# EAGLE design tc_breakout (EAGLE 9.6.2)

## Sheet 1 of 2
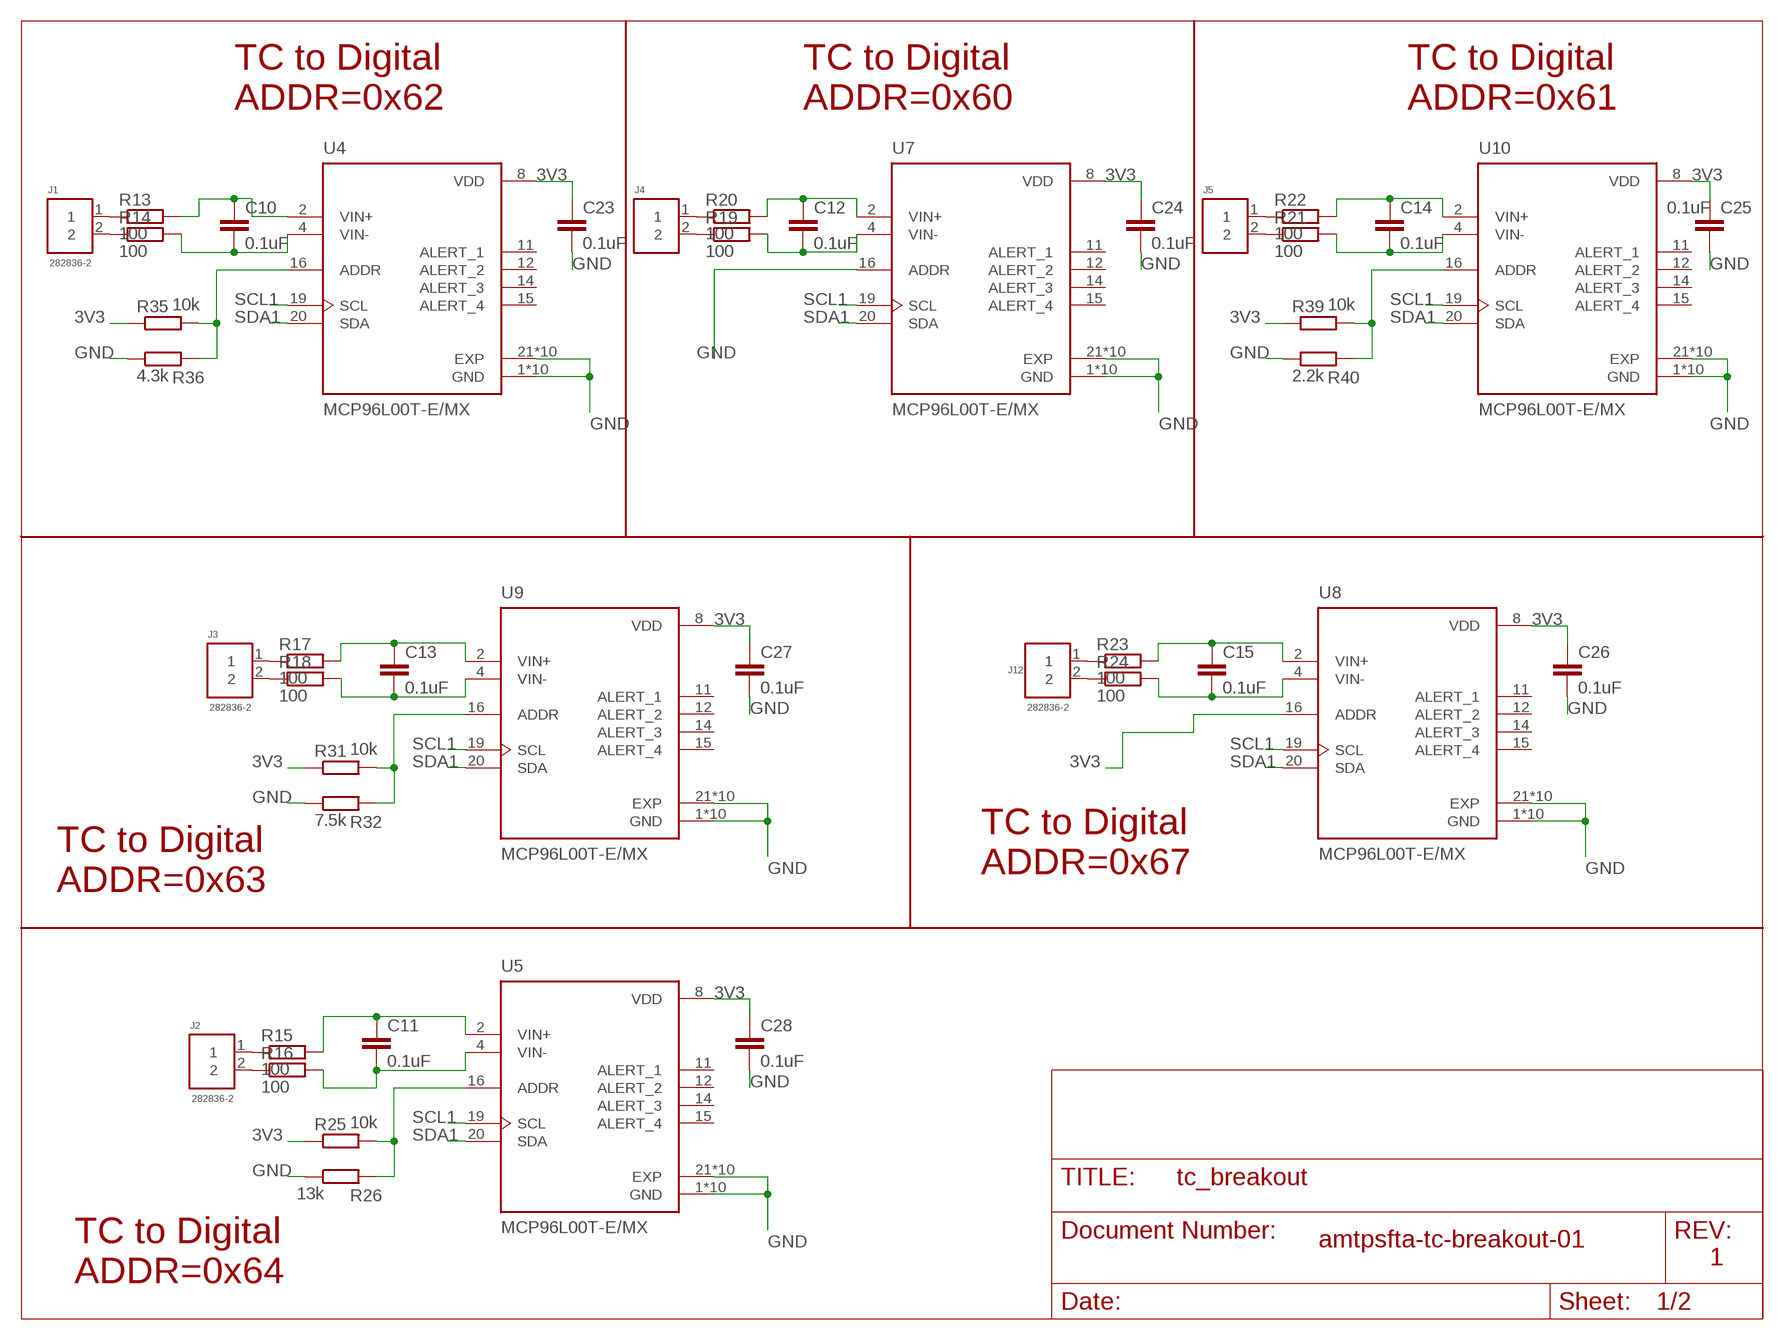
[diagram p0: schematic, sheet 1]

### Parts
C10  0.1uF  C-EUC0603  [C0603]
C11  0.1uF  C-EUC0603  [C0603]
C12  0.1uF  C-EUC0603  [C0603]
C13  0.1uF  C-EUC0603  [C0603]
C14  0.1uF  C-EUC0603  [C0603]
C15  0.1uF  C-EUC0603  [C0603]
C23  0.1uF  C-EUC0603  [C0603]
C24  0.1uF  C-EUC0603  [C0603]
C25  0.1uF  C-EUC0603  [C0603]
C26  0.1uF  C-EUC0603  [C0603]
C27  0.1uF  C-EUC0603  [C0603]
C28  0.1uF  C-EUC0603  [C0603]
J1  282836-2  [CONN_282836-2]
J2  282836-2  [CONN_282836-2]
J3  282836-2  [CONN_282836-2]
J4  282836-2  [CONN_282836-2]
J5  282836-2  [CONN_282836-2]
J12  282836-2  [CONN_282836-2]
R13  100  R-EU_R0603  [R0603]
R14  100  R-EU_R0603  [R0603]
R15  100  R-EU_R0603  [R0603]
R16  100  R-EU_R0603  [R0603]
R17  100  R-EU_R0603  [R0603]
R18  100  R-EU_R0603  [R0603]
R19  100  R-EU_R0603  [R0603]
R20  100  R-EU_R0603  [R0603]
R21  100  R-EU_R0603  [R0603]
R22  100  R-EU_R0603  [R0603]
R23  100  R-EU_R0603  [R0603]
R24  100  R-EU_R0603  [R0603]
R25  10k  R-EU_R0603  [R0603]
R26  13k  R-EU_R0603  [R0603]
R31  10k  R-EU_R0603  [R0603]
R32  7.5k  R-EU_R0603  [R0603]
R35  10k  R-EU_R0603  [R0603]
R36  4.3k  R-EU_R0603  [R0603]
R39  10k  R-EU_R0603  [R0603]
R40  2.2k  R-EU_R0603  [R0603]
U4  MCP96L00T-E/MX  [QFN65P500X500X100-21N_MCP96L00T-E/MX]
U5  MCP96L00T-E/MX  [QFN65P500X500X100-21N_MCP96L00T-E/MX]
U7  MCP96L00T-E/MX  [QFN65P500X500X100-21N_MCP96L00T-E/MX]
U8  MCP96L00T-E/MX  [QFN65P500X500X100-21N_MCP96L00T-E/MX]
U9  MCP96L00T-E/MX  [QFN65P500X500X100-21N_MCP96L00T-E/MX]
U10  MCP96L00T-E/MX  [QFN65P500X500X100-21N_MCP96L00T-E/MX]

### Nets
3V3: C23.1 C24.1 C25.1 C26.1 C27.1 C28.1 R25.1 R31.1 R35.1 R39.1 U4.8(VDD) U5.8(VDD) U7.8(VDD) U8.8(VDD) U8.16(ADDR) U9.8(VDD) U10.8(VDD) ; also sheet 2
GND: C23.2 C24.2 C25.2 C26.2 C27.2 C28.2 R26.1 R32.1 R36.1 R40.1 U4.1(GND) U4.3(GND) U4.5(GND) U4.6(GND) U4.7(GND) U4.9(GND) U4.10(GND) U4.13(GND) U4.17(GND) U4.18(GND) U4.21(EXP) U4.22(EXP) U4.23(EXP) U4.24(EXP) U4.25(EXP) U4.26(EXP) U4.27(EXP) U4.28(EXP) U4.29(EXP) U4.30(EXP) U5.1(GND) U5.3(GND) U5.5(GND) U5.6(GND) U5.7(GND) U5.9(GND) U5.10(GND) U5.13(GND) U5.17(GND) U5.18(GND) U5.21(EXP) U5.22(EXP) U5.23(EXP) U5.24(EXP) U5.25(EXP) U5.26(EXP) U5.27(EXP) U5.28(EXP) U5.29(EXP) U5.30(EXP) U7.1(GND) U7.3(GND) U7.5(GND) U7.6(GND) U7.7(GND) U7.9(GND) U7.10(GND) U7.13(GND) U7.16(ADDR) U7.17(GND) U7.18(GND) U7.21(EXP) U7.22(EXP) U7.23(EXP) U7.24(EXP) U7.25(EXP) U7.26(EXP) U7.27(EXP) U7.28(EXP) U7.29(EXP) U7.30(EXP) U8.1(GND) U8.3(GND) U8.5(GND) U8.6(GND) U8.7(GND) U8.9(GND) U8.10(GND) U8.13(GND) U8.17(GND) U8.18(GND) U8.21(EXP) U8.22(EXP) U8.23(EXP) U8.24(EXP) U8.25(EXP) U8.26(EXP) U8.27(EXP) U8.28(EXP) U8.29(EXP) U8.30(EXP) U9.1(GND) U9.3(GND) U9.5(GND) U9.6(GND) U9.7(GND) U9.9(GND) U9.10(GND) U9.13(GND) U9.17(GND) U9.18(GND) U9.21(EXP) U9.22(EXP) U9.23(EXP) U9.24(EXP) U9.25(EXP) U9.26(EXP) U9.27(EXP) U9.28(EXP) U9.29(EXP) U9.30(EXP) U10.1(GND) U10.3(GND) U10.5(GND) U10.6(GND) U10.7(GND) U10.9(GND) U10.10(GND) U10.13(GND) U10.17(GND) U10.18(GND) U10.21(EXP) U10.22(EXP) U10.23(EXP) U10.24(EXP) U10.25(EXP) U10.26(EXP) U10.27(EXP) U10.28(EXP) U10.29(EXP) U10.30(EXP) ; also sheet 2
N$22: J1.1 R13.1
N$25: J1.2 R14.1
N$28: J12.1 R23.1
N$32: C10.1 R13.2 U4.2(VIN+)
N$34: C10.2 R14.2 U4.4(VIN-)
N$36: J2.1 R15.1
N$37: J2.2 R16.1
N$38: J3.1 R17.1
N$39: J3.2 R18.1
N$40: J4.2 R19.1
N$41: J4.1 R20.1
N$42: J5.2 R21.1
N$43: J5.1 R22.1
N$44: J12.2 R24.1
N$45: C12.1 R20.2 U7.2(VIN+)
N$46: C12.2 R19.2 U7.4(VIN-)
N$47: C15.1 R23.2 U8.2(VIN+)
N$48: C14.2 R21.2 U10.4(VIN-)
N$49: C15.2 R24.2 U8.4(VIN-)
N$50: C14.1 R22.2 U10.2(VIN+)
N$51: C13.1 R17.2 U9.2(VIN+)
N$53: C13.2 R18.2 U9.4(VIN-)
N$54: C11.1 R15.2 U5.2(VIN+)
N$55: C11.2 R16.2 U5.4(VIN-)
N$57: R25.2 R26.2 U5.16(ADDR)
N$58: R31.2 R32.2 U9.16(ADDR)
N$60: R35.2 R36.2 U4.16(ADDR)
N$62: R39.2 R40.2 U10.16(ADDR)
SCL1: U4.19(SCL) U5.19(SCL) U7.19(SCL) U8.19(SCL) U9.19(SCL) U10.19(SCL) ; also sheet 2
SDA1: U4.20(SDA) U5.20(SDA) U7.20(SDA) U8.20(SDA) U9.20(SDA) U10.20(SDA) ; also sheet 2
Unconnected: U4.11(ALERT_1) U4.12(ALERT_2) U4.14(ALERT_3) U4.15(ALERT_4) U5.11(ALERT_1) U5.12(ALERT_2) U5.14(ALERT_3) U5.15(ALERT_4) U7.11(ALERT_1) U7.12(ALERT_2) U7.14(ALERT_3) U7.15(ALERT_4) U8.11(ALERT_1) U8.12(ALERT_2) U8.14(ALERT_3) U8.15(ALERT_4) U9.11(ALERT_1) U9.12(ALERT_2) U9.14(ALERT_3) U9.15(ALERT_4) U10.11(ALERT_1) U10.12(ALERT_2) U10.14(ALERT_3) U10.15(ALERT_4)

### Notes on the sheet
- TC to Digital
  ADDR=0x62
- TC to Digital
  ADDR=0x60
- TC to Digital
  ADDR=0x61
- TC to Digital
  ADDR=0x67
- TC to Digital
  ADDR=0x63
- amtpsfta-tc-breakout-01
- 1
- TC to Digital
  ADDR=0x64

## Sheet 2 of 2
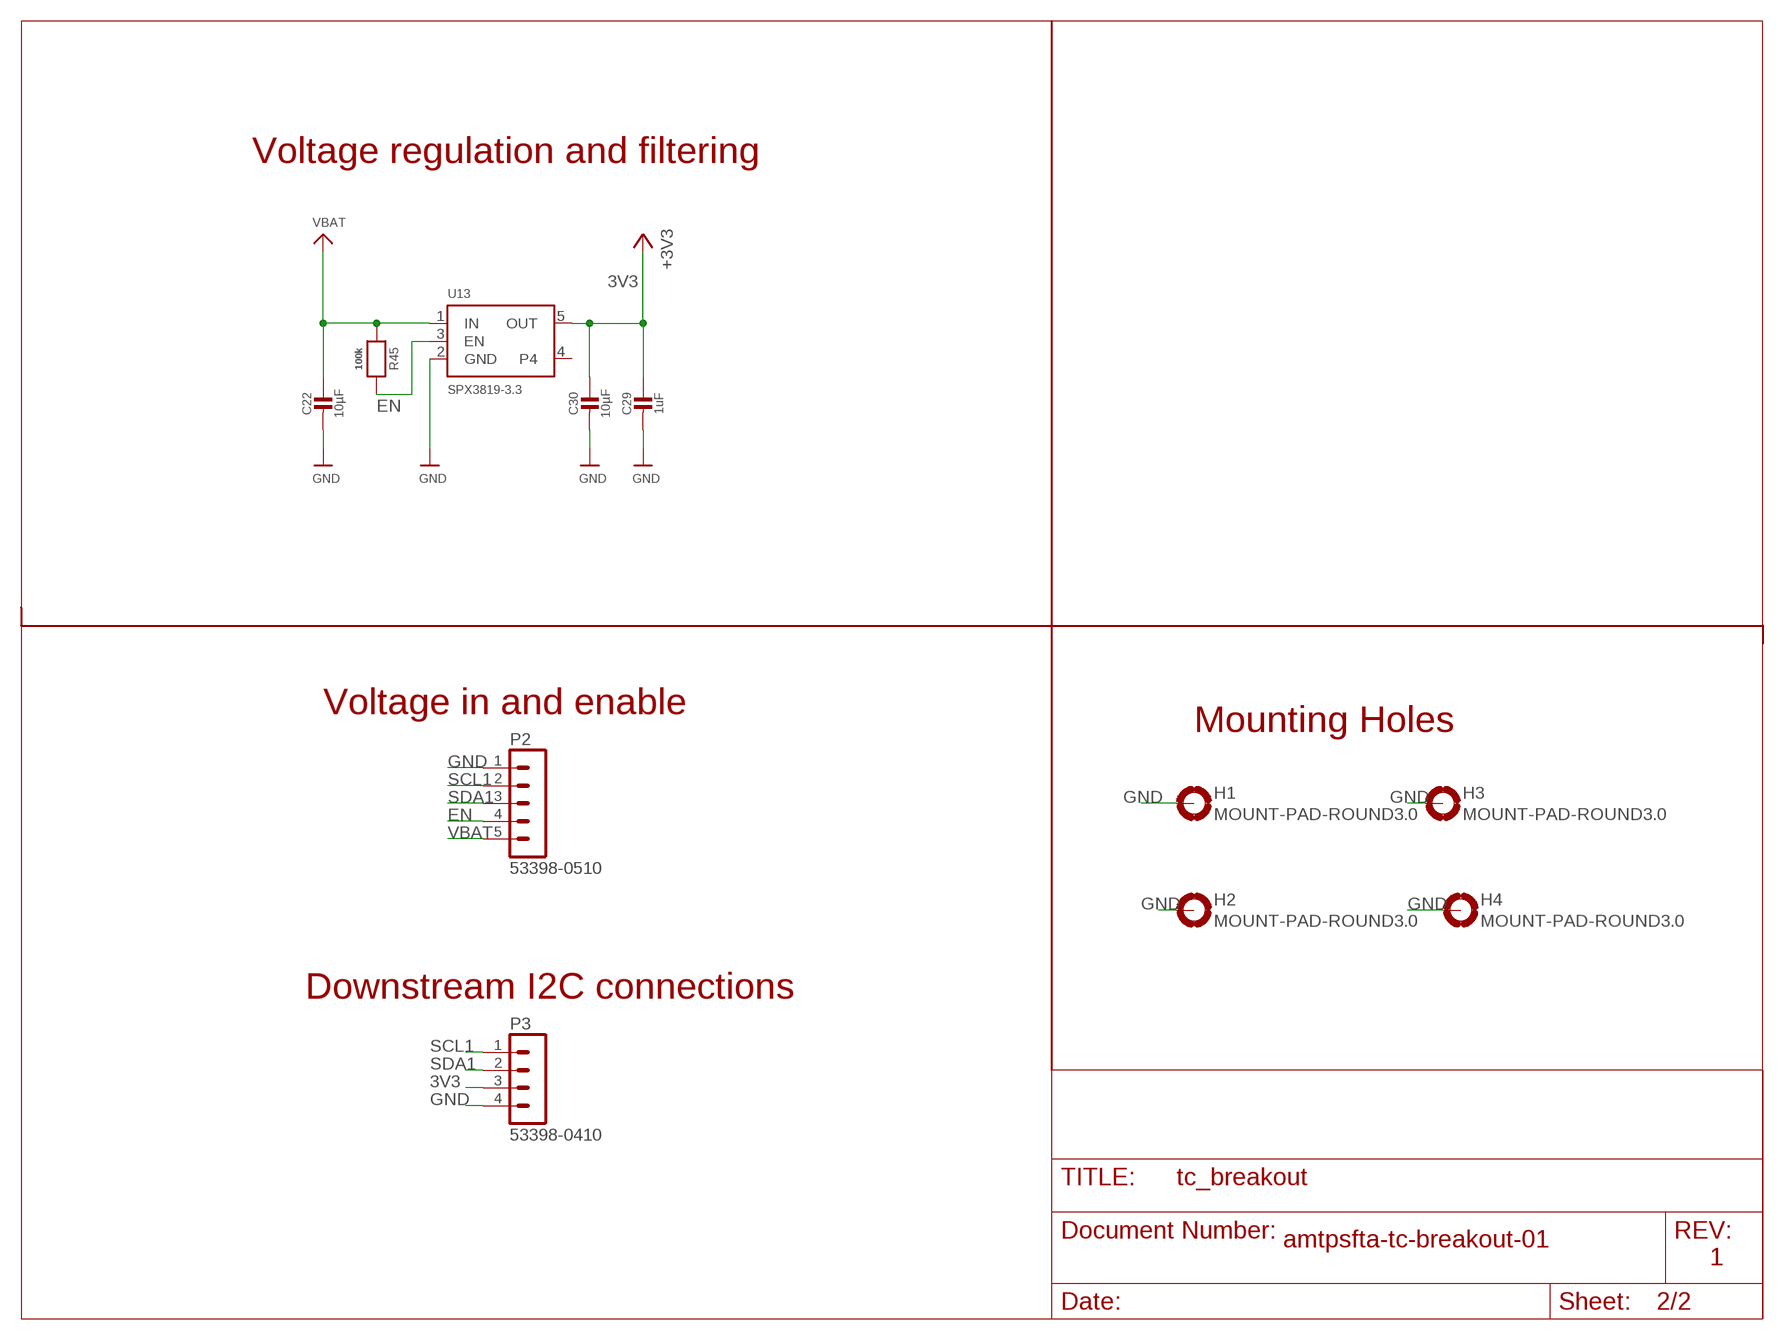
[diagram p1: schematic, sheet 2]

### Parts
C22  10µF  CAP_CERAMIC0805-NOOUTLINE  [0805-NO]
C29  1uF  CAP_CERAMIC0603_NO  [0603-NO]
C30  10µF  CAP_CERAMIC0805-NOOUTLINE  [0805-NO]
H1  MOUNT-PAD-ROUND3.0  [3,0-PAD]
H2  MOUNT-PAD-ROUND3.0  [3,0-PAD]
H3  MOUNT-PAD-ROUND3.0  [3,0-PAD]
H4  MOUNT-PAD-ROUND3.0  [3,0-PAD]
P2  53398-0510  [53398-0510]
P3  53398-0410  [53398-0410]
R45  100k  RESISTOR_0603_NOOUT  [0603-NO]
U13  SPX3819-3.3  VREG_SOT23-5  [SOT23-5]

### Nets
3V3: C29.1 C30.1 P3.3 U13.5(OUT) ; supply symbol labelled +3V3 ; also sheet 1
EN: P2.4 R45.2 U13.3(EN)
GND: C22.2 C29.2 C30.2 H1.B3,0(MOUNT) H2.B3,0(MOUNT) H3.B3,0(MOUNT) H4.B3,0(MOUNT) P2.1 P3.4 U13.2(GND) ; also sheet 1
SCL1: P2.2 P3.1 ; also sheet 1
SDA1: P2.3 P3.2 ; also sheet 1
VBAT: C22.1 P2.5 R45.1 U13.1(IN)
Unconnected: U13.4

### Notes on the sheet
- Voltage regulation and filtering
- Voltage in and enable
- Mounting Holes
- Downstream I2C connections
- amtpsfta-tc-breakout-01
- 1

## Library data of the parts
C10-C15 C23-C28 = rcl:C-EU: CAPACITOR, European symbol; SPICEPREFIX: C
C22 C29 C30 = microbuilder:CAP_CERAMIC: Ceramic Capacitors For new designs, use the packages preceded by an '_' character since they are more reliable: The following footprints should be used on most boards: _0402 - Standard footprint for regular board layouts _0603 - Standard footprint for regular board layouts _0805 - Standard footprint for regular board layouts _1206 - Standard footprint for regular board layouts For extremely tight-pitch boards where space is at a premium, the following 'micro-pitch' footprints can be used (smaller pads, no silkscreen outline, etc.): _0402MP - Micro-pitch footprint for very dense/compact boards _0603MP - Micro-pitch footprint for very dense/compact boards _0805MP - Micro-pitch footprint for very dense/compact boards _1206MP - Micro-pitch footprint for very dense/compact boards
H1-H4 = holes:MOUNT-PAD-ROUND: MOUNTING PAD, round
J1-J5 J12 = 282836-2:282836-2: TERM BLOCK 2POS SIDE ENTRY 5MM; DESCRIPTION: Conn Eurostyle Block 2 POS 5mm Solder ST Thru-Hole 13.5A/Contact; MF: TE Connectivity; MP: 2828362; PACKAGE: None
P2 = con-molex-picoblade:53398-0510: HEADER
P3 = con-molex-picoblade:53398-0410: HEADER
R13-R26 R31 R32 R35 R36 R39 R40 = rcl:R-EU_: RESISTOR, European symbol; SPICEPREFIX: R
R45 = microbuilder:RESISTOR: Resistors For new designs, use the packages preceded by an '_' character since they are more reliable: The following footprints should be used on most boards: _0402 - Standard footprint for regular board layouts _0603 - Standard footprint for regular board layouts _0805 - Standard footprint for regular board layouts _1206 - Standard footprint for regular board layouts For extremely tight-pitch boards where space is at a premium, the following 'micro-pitch' footprints can be used (smaller pads, no silkscreen outline, etc.): _0402MP - Micro-pitch footprint for very dense/compact boards _0603MP - Micro-pitch footprint for very dense/compact boards _0805MP - Micro-pitch footprint for very dense/compact boards _1206MP - Micro-pitch footprint for very dense/compact boards
U4 U5 U7-U10 = MCP96L00T-E_MX:MCP96L00T-E/MX: MCP9600 Series Thermocouple Electromotive Force to ±1.5°C Converter - VQFN-2; DESCRIPTION: +/- 4.0C THERMOCOUPLE TO I2C CON; DIGI-KEY_PART_NUMBER: MCP96L00T-E/MXCT-ND; MF: Microchip Technology; MP: MCP96L00T-E/MX; PACKAGE: VQFN-20 Microchip; PURCHASE-URL: https://pricing.snapeda.com/search/part/MCP96L00T-E/MX/?ref=eda
U13 = microbuilder:VREG_SOT23-5: SOT23-5 Fixed Voltage Regulators Part Current Out V Out V In V Dropout θJA (°C/W) TJ (°C) Digikey Part No. ADP121 150mA 3.3V 3.4-5.5V 0.09V @ 150mA -- -- ADP121-AUJZ33R7CT-ND ADP121 150mA 3.0V 3.1-5.5V 0.09V @ 150mA -- -- ADP121-AUJZ30R7CT-ND ADP122 300mA 3.3V 3.4-5.5V 0.085V @ 300mA -- -- ADP122AUJZ-3.3-R7CT-ND ADP1712 300mA 3.3V 3.5-5.5V 0.17V @ 300mA -- -- ADP1712AUJZ-3.3-R7TR-ND AP7311 (Low Cost) 150mA 3.3V 3.5-6V 0.15V @ 150mA -- -- AP7311-33WG-7DICT-ND LD39015M18R 150mA 1.8V 1.9V-5.5V 0.08V @ 100mA -- -- 497-6977-1-ND LP2985A-33DBVR 150mA 3.3V 3.3-16V 0.28V @ 150mA 206 150 296-18479-1-ND MCP1824T-3302E/OT 300mA 3.3V 3.5V-6V 0.2V @ 300mA -- -- MCP1824T-3302E/OTCT-ND MIC5205-2.5YM5 TR 150mA 2.5V 2.7-16V 0.165V @ 150mA -- -- 576-1257-2-ND MIC5205-3.0YM5 TR 150mA 3.0V 3.2V-16V 0.165V @ 150mA -- -- 576-1258-2-ND MIC5205-3.3YM5 TR 150mA 3.3V 3.5V-16V 0.165V @ 150mA -- -- 576-1259-2-ND TPS780330220 150mA 3.3V+2.2V 3.6-5.5V 250mV Max -- -- 296-23332-1-ND TDA3663/N1,135 100mA 3.3V 3.5-45V 0.18V @ 50mA -- -- 568-5343-1-ND Max operating temp can be calculated using θJA, TJ (max junction temperature), and power in watts. Set the "Maximum Ambient Temperature" until it reaches TJ ("Max Junction Temperature"), which is the absolute limit for safe use of the regulator: Heat Sink Temperature Calculator <http://www.daycounter.com/Calculators/Heat-Sink-Temperature-Calculator.phtml> For example, With 12V source into a 3.3V LP2985 and a 30mA load, we are dissipating (12V-3.3V) * 0.03A = 0.261W. With a θJA of 206 °C/W, a TJ of 150°C, and 261mW we can safely use the chip without a heat sink up to 75°C (=147.1°C Junction Temperature).

## Board
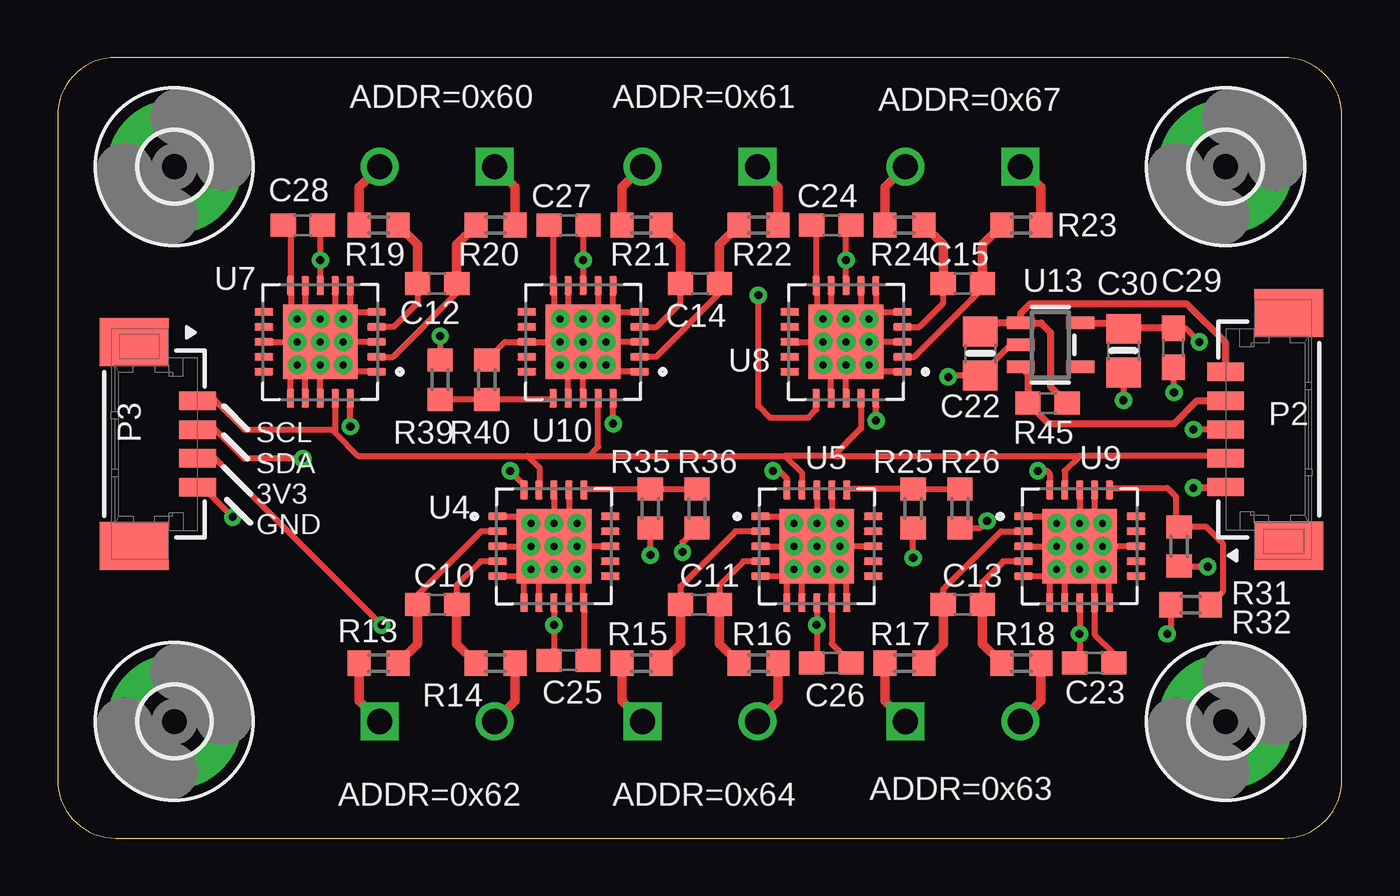
[diagram p2: board, top side]
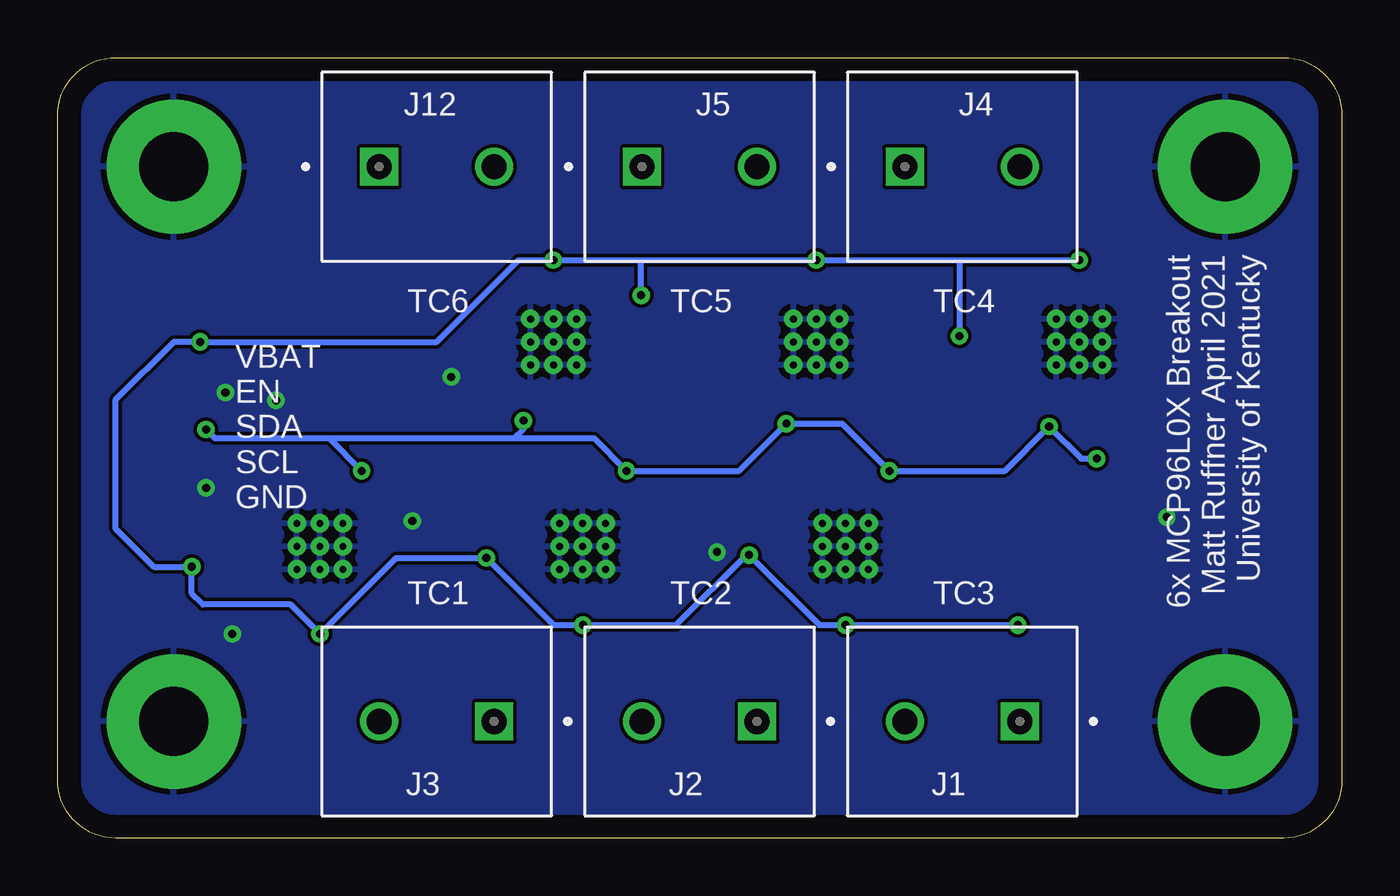
[diagram p3: board, bottom side, seen from below]

Size 55.86 x 33.96 mm. Coordinates in mm from the lower left corner, seen from the top.
Outline: 0,31.42 0,2.54 arc90 2.54,0 53.32,0 arc90 55.86,2.54 55.86,31.42 arc90 53.32,33.96 2.54,33.96 arc90 0,31.42
Copper layers (1*16): Top 0.035mm / dielectric 1.5mm / Bottom 0.035mm
Design rules "default *": minimum track width 6mil, minimum drill 0.35mm, track to track 6mil, track to pad 6mil, pad to pad 6mil, via to via 6mil, smd to smd 6mil, copper to edge 40mil, drill to drill 6mil, minimum pad ring 10mil, minimum via ring 8mil, stop-mask expansion 4mil, vias tented up to drill 14mil, thermal gap 10mil

### Footprints (pad centres in the part's own frame; a part is rotated, then mirrored left to right if it is on the bottom)
C0603 = smd 1.1 x 1: 1 -0.85,0; 2 0.85,0
0805-NO = smd 1.3 x 1.5: 1 -0.95,0; 2 0.95,0
0603-NO = smd 1.1 x 1: 1 -0.85,0; 2 0.85,0
3,0-PAD = drill 3 pad 5.842: B3,0 0,0
CONN_282836-2 = drill 1.1 square: 1 -2.5,0 | drill 1.1: 2 2.5,0
53398-0510 = smd 0.8 x 1.6: 1 2.5,0; 2 1.25,0; 3 0,0; 4 -1.25,0; 5 -2.5,0 | smd 2.1 x 3: M1 5.06,2.75; M2 -5.06,2.75
53398-0410 = smd 0.8 x 1.6: 1 1.875,0; 2 0.625,0; 3 -0.625,0; 4 -1.875,0 | smd 2.1 x 3: M1 4.435,2.75; M2 -4.435,2.75
R0603 = smd 1 x 1.1: 1 -0.85,0; 2 0.85,0
QFN65P500X500X100-21N_MCP96L00T-E/MX = smd 0.81 x 0.32: 1 -2.45,1.3; 2 -2.45,0.65; 3 -2.45,0; 4 -2.45,-0.65; 5 -2.45,-1.3; 11 2.45,-1.3; 12 2.45,-0.65; 13 2.45,0; 14 2.45,0.65; 15 2.45,1.3 | smd 0.32 x 0.81: 6 -1.3,-2.45; 7 -0.65,-2.45; 8 0,-2.45; 9 0.65,-2.45; 10 1.3,-2.45; 16 1.3,2.45; 17 0.65,2.45; 18 0,2.45; 19 -0.65,2.45; 20 -1.3,2.45 | smd 3.25 x 3.25: 21 0,0 | drill 0.3 pad 0.5: 22 -1,1; 23 0,1; 24 1,1; 25 -1,0; 26 0,0; 27 1,0; 28 -1,-1; 29 0,-1; 30 1,-1
SOT23-5 = smd 0.55 x 1.2: 1 -0.95,-1.3; 2 0,-1.3; 3 0.95,-1.3; 4 0.95,1.3; 5 -0.95,1.3

### Placement (x,y rotation side)
C10  16.51,10.16 0 top
C11  27.94,10.16 0 top
C12  16.51,24.13 180 top
C13  39.37,10.16 0 top
C14  27.94,24.13 180 top
C15  39.37,24.13 180 top
C22  40.13,21.08 270 top
C23  45.09,7.62 0 top
C24  33.66,26.67 180 top
C25  22.23,7.75 0 top
C26  33.66,7.62 0 top
C27  22.23,26.67 180 top
C28  10.67,26.67 180 top
C29  48.51,21.34 270 top
C30  46.35,21.21 270 top
H1  5.08,5.08 0 top
H2  50.8,5.08 0 top
H3  5.08,29.21 0 top
H4  50.8,29.21 0 top
J1  16.51,5.08 180 bottom
J2  27.94,5.08 180 bottom
J3  39.37,5.08 180 bottom
J4  16.51,29.21 0 bottom
J5  27.94,29.21 0 bottom
J12  39.37,29.21 0 bottom
P2  50.8,17.78 270 top
P3  6.1,17.14 90 top
R13  13.97,7.62 0 top
R14  19.05,7.62 180 top
R15  25.4,7.62 0 top
R16  30.48,7.62 180 top
R17  36.83,7.62 0 top
R18  41.91,7.62 180 top
R19  13.97,26.67 0 top
R20  19.05,26.67 180 top
R21  25.4,26.67 0 top
R22  30.48,26.67 180 top
R23  41.91,26.67 180 top
R24  36.83,26.67 0 top
R25  37.21,14.35 90 top
R26  39.24,14.35 90 top
R31  48.77,12.7 90 top
R32  49.28,10.16 0 top
R35  25.78,14.35 90 top
R36  27.81,14.35 90 top
R39  16.64,19.94 270 top
R40  18.67,19.94 270 top
R45  43.05,18.92 180 top
U4  21.59,12.7 0 top
U5  33.02,12.7 0 top
U7  11.43,21.59 180 top
U8  34.29,21.59 180 top
U9  44.45,12.7 0 top
U10  22.86,21.59 180 top
U13  43.18,21.46 270 top

### Tracks (layer width: path | path; a pad name or v marks a point on that pad's centre or on a via)
3V3  (via drill 0.35)
  Top 0.254: C23.1 44.45,8.22 v44.45,8.89 | U9.8 v44.45,8.89 | U4.8 v21.59,9.27 21.59,7.96 C25.1 | C28.1 11.43,26.58 v11.43,25.15 U7.8 | C27.1 22.86,26.45 v22.86,25.15 U10.8 | U8.8 v34.29,25.15 34.29,26.45 C24.1 | U5.8 v33.02,9.26 | v33.02,9.26 33.02,7.83 C26.1 | C29.1 49.06,22.19 v49.66,21.59 | v50.02,11.81 48.81,11.81 R31.1 | v44.45,8.89 v44.44,8.89 | v37.21,12.19 R25.1 | v33.01,9.27 v33.02,9.26 | v25.78,12.32 R35.1 | v16.64,21.84 R39.1 | U8.16 32.99,18.64 32.64,18.29 30.99,18.29 30.48,18.8 v30.48,23.62 | P3.3 6.85,16.52 v14.1,9.27
  Top 0.305: U13.5 46.1,22.41 C30.1 46.38,22.19 C29.1
  Bottom 0.254: 30.48,25.15 v34.29,25.15 35.81,25.15 39.37,21.59 v49.66,21.59 50.8,21.59 53.34,19.05 53.34,13.48 51.67,11.81 v50.02,11.81 50.02,10.64 49.53,10.16 45.71,10.16 v44.44,8.89 41.14,12.19 v37.21,12.19 34.29,9.27 v33.01,9.27 28.96,9.27 25.91,12.32 v25.78,12.32 22.73,9.27 v21.59,9.27 v14.1,9.27 | 30.48,25.15 v22.86,25.15 16.51,25.15 | 16.51,25.15 v11.43,25.15 | 16.51,25.15 16.64,25.02 v16.64,21.84 | v30.48,23.62 30.48,25.15
EN
  Top 0.305: U13.3 42.2,20.19 R45.2 43.09,18.03 48.56,18.03 49.55,19.03 P2.4
GND  (via drill 0.35)
  Top 0.254: U7.18 U7.23 | U7.13 10.16,21.59 | 10.16,21.59 U7.27 10.13,21.29 U7.16 | U7.6 12.73,22.89 12.7,22.86 | 12.7,22.86 U7.26 | U7.3 U7.25 | U7.5 13.85,22.86 12.7,22.86 | U7.1 12.73,20.29 U7.26 | R40.1 19.47,21.59 U10.13 21.59,21.59 | 21.59,21.59 U10.27 | C27.2 21.56,26.48 U10.10 21.59,24.01 21.59,22.86 U10.26 | C28.2 10.13,26.36 U7.10 10.16,24.01 10.16,22.86 U7.30 | C24.2 32.99,26.48 U8.10 33.02,24.01 33.02,22.86 U8.30 | U8.13 U8.27 | U8.18 U8.23 33.78,20.59 33.64,20.45 U8.17 | U8.1 35.59,20.29 U8.22 | U8.3 35.56,21.59 | 35.56,21.59 U8.25 | U8.5 36.71,22.86 34.29,22.86 U8.29 | U10.18 U10.23 | U10.17 22.21,20.97 21.59,21.59 | U7.17 10.78,20.97 10.16,21.59 | U10.5 25.28,22.86 24.13,22.86 | 24.13,22.86 U10.28 | U10.3 U10.25 | U10.1 24.16,20.29 U10.22 | C30.2 v46.35,19.05 | C29.2 48.51,19.43 v48.56,19.39 48.48,19.3 | v38.73,20.07 38.8,20.13 C22.2 41.46,21.46 U13.2 | U9.18 U9.26 | U9.17 45.1,13.05 U9.27 | R32.1 48.43,9.06 v48.26,8.89 | U9.30 45.1,11.35 U9.9 45.1,8.88 45.94,8.04 C23.2 | U9.10 45.72,10.28 45.72,12.7 U9.27 | U9.13 U9.27 | U9.1 43.15,14 U9.22 | U9.3 U9.25 | U9.5 43.15,11.4 U9.28 | U9.7 43.8,12.35 U9.25 | U9.6 43.15,12.4 U9.25 | U5.3 U5.25 | U5.1 31.72,14 U5.22 | U5.5 31.72,11.4 | U5.6 31.72,11.4 | 31.72,11.4 U5.28 32.37,11.35 U5.7 | U5.10 34.32,11.4 U5.30 33.67,11.35 U5.9 33.67,8.46 C26.2 | U5.13 U5.27 | U5.18 U5.23 | R36.1 27.18,12.87 v27.18,12.45 | U4.13 22.86,12.7 | 22.86,12.7 U4.27 | U4.18 U4.23 | U4.17 22.24,14.05 U4.24 | 22.86,12.7 22.86,10.28 U4.10 22.89,7.93 C25.2 | U4.9 22.24,11.35 U4.30 | U4.7 20.94,11.35 U4.28 20.29,11.4 | U4.6 20.29,11.4 | U4.3 U4.25 | U4.1 20.29,14 U4.22 | U4.5 20.29,11.4 | R26.1 40.13,13.5 v40.43,13.8 | U7.9 10.78,22.24 U7.26
  Top 0.254: U7.7 12.08,22.24 U7.26 | U10.9 22.21,22.24 U10.26 | U10.7 23.51,22.24 U10.26 | U10.6 24.13,24.01 24.13,22.86 | U8.9 33.64,22.24 U8.26 34.94,22.24 U8.7 | U8.6 35.59,21.62 35.56,21.59 | U5.17 33.67,14.05 U5.24 | P3.4 6.32,15.27 v7.62,13.97
  Top 0.305: P2.1 50.76,15.24 v49.4,15.24
  pour Bottom: -1.27,36.83 57.15,36.83 57.15,-1.27 -1.27,-1.27
N$22
  Top 0.406: J1.1 13.12,5.97 R13.1
N$25
  Top 0.406: J1.2 19.9,5.97 R14.1
N$28
  Top 0.406: R23.1 42.76,28.32 J12.1
N$32
  Top 0.254: U4.2 18.43,13.35 15.66,10.58 C10.1
  Top 0.406: R13.2 15.66,8.46 C10.1
N$34
  Top 0.254: U4.4 18.4,12.05 17.36,11.01 C10.2
  Top 0.406: R14.2 17.36,8.46 C10.2
N$36
  Top 0.406: R15.1 24.55,5.97 J2.1
N$37
  Top 0.406: R16.1 31.33,5.97 J2.2
N$38
  Top 0.406: R17.1 35.98,5.97 J3.1
N$39
  Top 0.406: R18.1 42.76,5.97 J3.2
N$40
  Top 0.406: J4.2 13.12,28.32 R19.1
N$41
  Top 0.406: J4.1 19.9,28.32 R20.1
N$42
  Top 0.406: R21.1 24.55,28.32 J5.2
N$43
  Top 0.406: J5.1 31.33,28.32 R22.1
N$44
  Top 0.406: R24.1 35.98,28.32 J12.2
N$45
  Top 0.254: U7.2 14.59,20.94 17.36,23.71 C12.1
  Top 0.406: R20.2 17.36,25.83 C12.1
N$46
  Top 0.254: C12.2 15.66,23.28 14.62,22.24 U7.4
  Top 0.406: R19.2 15.66,25.83 C12.2
N$47
  Top 0.254: U8.2 37.24,20.94 40.22,23.91 C15.1
  Top 0.406: R23.2 40.22,25.83 C15.1
N$48
  Top 0.254: U10.4 26.05,22.24 27.09,23.28 C14.2
  Top 0.406: R21.2 27.09,25.83 C14.2
N$49
  Top 0.254: U8.4 37.48,22.24 38.52,23.28 C15.2
  Top 0.406: R24.2 38.52,25.83 C15.2
N$50
  Top 0.254: C14.1 28.79,23.71 26.02,20.94 U10.2
  Top 0.406: R22.2 28.79,25.83 C14.1
N$51
  Top 0.254: C13.1 38.52,10.83 41.04,13.35 U9.2
  Top 0.406: R17.2 38.52,8.46 C13.1
N$53
  Top 0.254: U9.4 41.13,12.05 40.22,11.14 C13.2
  Top 0.406: R18.2 40.22,8.46 C13.2
N$54
  Top 0.254: U5.2 29.48,13.35 27.09,10.96 C11.1
  Top 0.406: R15.2 27.09,8.46 C11.1
N$55
  Top 0.254: U5.4 29.83,12.05 28.79,11.01 C11.2
  Top 0.406: C11.2 28.79,8.46 R16.2
N$57
  Top 0.254: R26.2 R25.2 34.37,15.2 U5.16
N$58
  Top 0.254: U9.16 45.84,15.24 48.26,15.24 48.64,14.86 48.64,13.68 R31.2 49.95,13.55 50.67,12.83 50.67,10.71 R32.2
N$60
  Top 0.254: U4.16 22.94,15.2 R35.2 R36.2
N$62
  Top 0.254: U10.16 21.51,19.09 R40.2 R39.2
SCL1
  Top 0.254: U7.19 12.08,17.64 | 20.45,16.64 20.95,16.13 20.95,15.16 U4.19 | 12.08,17.64 13.08,16.64 20.45,16.64 | 20.45,16.64 23.11,16.64 | 23.11,16.64 23.51,17.03 U10.19 | 23.11,16.64 31.62,16.64 | U5.19 32.37,15.89 31.62,16.64 | 33.74,16.64 31.62,16.64 | U8.19 34.94,17.84 33.74,16.64 | P2.2 50.69,16.64 44.45,16.64 | 44.45,16.64 43.8,15.99 U9.19 | 33.74,16.64 44.45,16.64 | 12.08,17.64 11.95,17.77 8.14,17.77 6.89,19.02 P3.1
SDA1  (via drill 0.35)
  Top 0.254: P2.3 v49.4,17.78 | v35.6,18.16 v35.59,18.17 U8.20 | v31.11,15.98 31.39,15.98 31.72,15.65 U5.20 | v24.17,18.03 24.16,18.04 U10.20 | v19.68,15.98 20.29,15.37 U4.20 | v12.74,17.91 v12.73,17.92 U7.20 | v42.63,15.98 43.02,15.98 43.15,15.85 U9.20 | 10.66,16.52 v10.67,16.51 8.13,16.51 6.87,17.77 P3.2
  Bottom 0.254: v49.4,17.78 49.02,17.4 44.05,17.4 | 44.05,17.4 35.98,17.4 | 35.98,17.4 35.6,17.78 v35.6,18.16 | 35.98,17.4 32.53,17.4 v31.11,15.98 26.22,15.98 v24.17,18.03 21.74,18.03 v19.68,15.98 14.67,15.98 v12.74,17.91 11.34,16.51 v10.67,16.51 | 42.65,15.98 v42.63,15.98 44.05,17.4
VBAT
  Top 0.305: P2.5 50.8,21.55 49.11,23.24 42.29,23.24 41.88,22.83 U13.1 | C22.1 40.51,22.41 U13.1 | U13.1 42.77,22.41 43.18,22 43.18,19.65 R45.1

### Text on the board
tNames: ADDR=0x60 | ADDR=0x61 | ADDR=0x67 | SCL / SDA / 3V3 / GND | ADDR=0x63 | ADDR=0x62 | ADDR=0x64
bNames: 6x MCP96L0X Breakout / Matt Ruffner April 2021 / University of Kentucky | TC4 | TC5 | TC6 | VBAT / EN / SDA / SCL / GND | TC3 | TC2 | TC1
Measures: IN